# Altium schematic sheet V1.0.SchDoc
size 88 x 45 mm
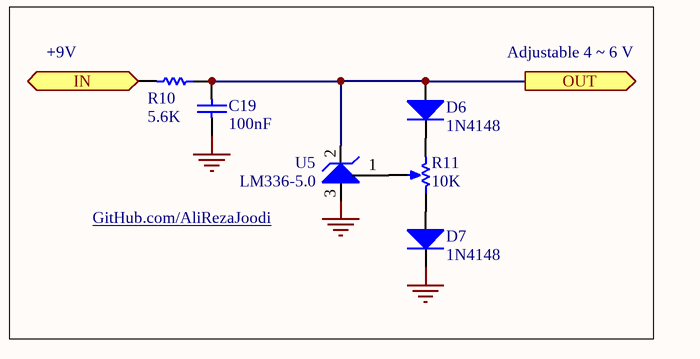
[diagram p0: V1.0.SchDoc]

## Parts
C19  value 100nF  [CAPNTO2.54-3.05x1.78A]  (hidden comment: Cap)
D6  1N4148  [DIODE0.4_Glass]
D7  1N4148  [DIODE0.4_Glass]
R10  value 5.6K  [AXIAL-0.4]  (hidden comment: Res1)
R11  value 10K  [VR4_]  (hidden comment: POT)
U5  LM336-5.0  [TO92C]

## Ports
IN (in), OUT (out)

## Nets
GND: C19.2 D7.2(K) U5.3(-)
IN: R10.2 ; port IN
OUT: C19.1 D6.1(A) R10.1 U5.2(+) ; port OUT
NetD6_2: D6.2(K) R11.2(BOT)
NetD7_1: D7.1(A) R11.1(TOP)
NetR11_3: R11.3(TAP) U5.1(Adj)

## Notes on the sheet
- +9V
- Adjustable 4 ~ 6 V
- GitHub.com/AliRezaJoodi

## Library data of the parts
C19 = Cap: Capacitor; Manufacturer: Generic Components; Class I: Passive; Published: 8-Jun-2000; Revision: July-2002: Re-released for DXP Platform.; Publisher: Altium Limited; Class II: Capacitor
D6 D7 = Diode: Default Diode; Manufacturer: Generic Components; Class I: Discrete; Class II: Diode - Switching; Published: 8-Jun-2000; Revision: July-2002: Re-released for DXP Platform.; Publisher: Altium Limited
R10 = Res1: Resistor; Published: 8-Jun-2000; LatestRevisionDate: 17-Jul-2002; LatestRevisionNote: Re-released for DXP Platform.; PackageReference: AXIAL-0.3; Publisher: Altium Limited
R11 = RPot1: Potentiometer; Manufacturer: Generic Components; Class I: Passive; Set Position: 0.5; Published: 8-Jun-2000; Revision: July-2002: Re-released for DXP Platform.; Publisher: Altium Limited; Class II: Potentiometer
U5 = LM336: Programmable Shunt Regulator; Value: +5V; Revision: July-2002: Re-released for DXP Platform.